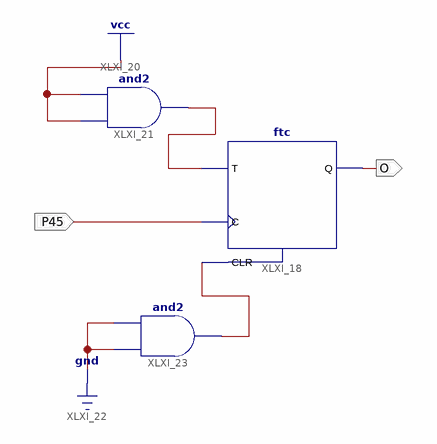
[diagram p0: schematic sheet 1]
// Xilinx ISE schematic SWW.sch (spartan6) as structural Verilog: 3 symbols, 2 ports
module SWW (
  input  P45,
  output O
);

  wire XLXN_69, XLXN_72;

  and XLXI_21 (XLXN_69, 1'b1, 1'b1);
  ftc XLXI_18 (.C(P45), .CLR(XLXN_72), .T(XLXN_69), .Q(O));
  and XLXI_23 (XLXN_72, 1'b0, 1'b0);
endmodule
